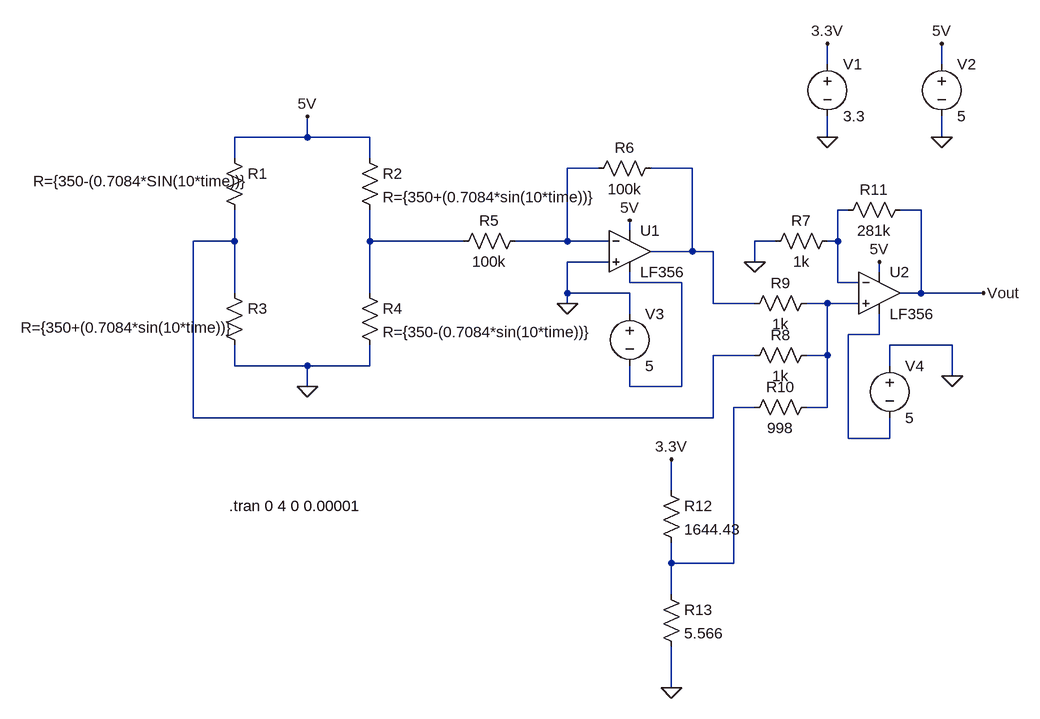
[diagram p0: schematic WheatstoneAndAmplifier.asc]
WheatstoneAndAmplifier.asc, the LTspice schematic file:
Version 4
SHEET 1 880 1060
WIRE 80 80 80 48
WIRE 256 80 256 48
WIRE -720 192 -720 160
WIRE -720 192 -832 192
WIRE -624 192 -720 192
WIRE 80 192 80 160
WIRE 256 192 256 160
WIRE -832 224 -832 192
WIRE -624 224 -624 192
WIRE -272 240 -320 240
WIRE -128 240 -192 240
WIRE 112 304 96 304
WIRE 224 304 192 304
WIRE -224 336 -224 320
WIRE -832 352 -832 304
WIRE -832 352 -896 352
WIRE -624 352 -624 304
WIRE -480 352 -624 352
WIRE -320 352 -320 240
WIRE -320 352 -400 352
WIRE -256 352 -320 352
WIRE 0 352 -32 352
WIRE 96 352 96 304
WIRE 96 352 80 352
WIRE -128 368 -128 240
WIRE -128 368 -192 368
WIRE -96 368 -128 368
WIRE -256 384 -320 384
WIRE -32 384 -32 352
WIRE 160 400 160 384
WIRE -224 416 -224 400
WIRE -144 416 -224 416
WIRE 96 416 96 352
WIRE 128 416 96 416
WIRE -832 432 -832 352
WIRE -624 432 -624 352
WIRE -320 432 -320 384
WIRE -224 432 -320 432
WIRE 224 432 224 304
WIRE 224 432 192 432
WIRE 320 432 224 432
WIRE -320 448 -320 432
WIRE -96 448 -96 368
WIRE -32 448 -96 448
WIRE 80 448 48 448
WIRE 128 448 80 448
WIRE -224 464 -224 432
WIRE 160 496 160 464
WIRE 160 496 112 496
WIRE 272 512 176 512
WIRE -32 528 -96 528
WIRE 80 528 80 448
WIRE 80 528 48 528
WIRE -832 544 -832 512
WIRE -720 544 -832 544
WIRE -624 544 -624 512
WIRE -624 544 -720 544
WIRE 176 544 176 512
WIRE 272 560 272 512
WIRE -720 576 -720 544
WIRE -224 576 -224 544
WIRE -144 576 -144 416
WIRE -144 576 -224 576
WIRE -32 608 -64 608
WIRE 80 608 80 528
WIRE 80 608 48 608
WIRE -896 624 -896 352
WIRE -96 624 -96 528
WIRE -96 624 -896 624
WIRE 112 656 112 496
WIRE 176 656 176 624
WIRE 176 656 112 656
WIRE -160 736 -160 688
WIRE -160 848 -160 816
WIRE -64 848 -64 608
WIRE -64 848 -160 848
WIRE -160 896 -160 848
WIRE -160 1040 -160 976
FLAG 80 192 0
FLAG 256 192 0
FLAG 80 48 3.3V
FLAG 256 48 5V
FLAG -720 576 0
FLAG -720 160 5V
FLAG -320 448 0
FLAG -32 384 0
FLAG 320 432 Vout
FLAG -160 1040 0
FLAG -160 688 3.3V
FLAG -224 320 5V
FLAG 160 384 5V
FLAG 272 560 0
SYMBOL voltage 80 64 R0
WINDOW 123 0 0 Left 0
WINDOW 39 0 0 Left 0
SYMATTR InstName V1
SYMATTR Value 3.3
SYMBOL voltage 256 64 R0
WINDOW 123 0 0 Left 0
WINDOW 39 0 0 Left 0
SYMATTR InstName V2
SYMATTR Value 5
SYMBOL res -848 208 R0
WINDOW 3 -294 52 Left 2
SYMATTR InstName R1
SYMATTR Value R={350-(0.7084*SIN(10*time))}
SYMBOL res -640 208 R0
SYMATTR InstName R2
SYMATTR Value R={350+(0.7084*sin(10*time))}
SYMBOL res -848 416 R0
WINDOW 3 -313 69 Left 2
SYMATTR InstName R3
SYMATTR Value R={350+(0.7084*sin(10*time))}
SYMBOL res -640 416 R0
SYMATTR InstName R4
SYMATTR Value R={350-(0.7084*sin(10*time))}
SYMBOL res -384 336 R90
WINDOW 0 0 56 VBottom 2
WINDOW 3 32 56 VTop 2
SYMATTR InstName R5
SYMATTR Value 100k
SYMATTR SpiceLine tol=5 pwr=.5
SYMBOL res -176 224 R90
WINDOW 0 0 56 VBottom 2
WINDOW 3 32 56 VTop 2
SYMATTR InstName R6
SYMATTR Value 100k
SYMATTR SpiceLine tol=5 pwr=.5
SYMBOL res 96 336 R90
WINDOW 0 0 56 VBottom 2
WINDOW 3 32 56 VTop 2
SYMATTR InstName R7
SYMATTR Value 1k
SYMBOL res 64 512 R90
WINDOW 0 0 56 VBottom 2
WINDOW 3 32 56 VTop 2
SYMATTR InstName R8
SYMATTR Value 1k
SYMATTR SpiceLine tol=5 pwr=.5
SYMBOL res 64 432 R90
WINDOW 0 0 56 VBottom 2
WINDOW 3 32 56 VTop 2
SYMATTR InstName R9
SYMATTR Value 1k
SYMATTR SpiceLine tol=5 pwr=.5
SYMBOL res 64 592 R90
WINDOW 0 0 56 VBottom 2
WINDOW 3 32 56 VTop 2
SYMATTR InstName R10
SYMATTR Value 998
SYMATTR SpiceLine tol=5 pwr=.5
SYMBOL res 208 288 R90
WINDOW 0 0 56 VBottom 2
WINDOW 3 32 56 VTop 2
SYMATTR InstName R11
SYMATTR Value 281k
SYMATTR SpiceLine tol=5 pwr=.5
SYMBOL res -176 720 R0
SYMATTR InstName R12
SYMATTR Value 1644.43
SYMATTR SpiceLine tol=5 pwr=.5
SYMBOL res -176 880 R0
SYMATTR InstName R13
SYMATTR Value 5.566
SYMATTR SpiceLine tol=5 pwr=.5
SYMBOL Opamps\\LF356 -224 304 R0
SYMATTR InstName U1
SYMBOL voltage -224 448 R0
WINDOW 123 0 0 Left 0
WINDOW 39 0 0 Left 0
SYMATTR InstName V3
SYMATTR Value 5
SYMBOL Opamps\\LF356 160 368 R0
SYMATTR InstName U2
SYMBOL voltage 176 528 R0
WINDOW 123 0 0 Left 0
WINDOW 39 0 0 Left 0
SYMATTR InstName V4
SYMATTR Value 5
TEXT -840 760 Left 2 !.tran 0 4 0 0.00001

The netlist it stands for:
* WheatstoneAndAmplifier.asc
V1 3.3V 0 3.3
V2 5V 0 5
R1 5V N004 R={350-(0.7084*SIN(10*time))}
R2 5V N005 R={350+(0.7084*sin(10*time))}
R3 N004 0 R={350+(0.7084*sin(10*time))}
R4 N005 0 R={350-(0.7084*sin(10*time))}
R5 N001 N005 100k tol=5 pwr=.5
R6 N002 N001 100k tol=5 pwr=.5
R7 N003 0 1k
R8 N007 N004 1k tol=5 pwr=.5
R9 N007 N002 1k tol=5 pwr=.5
R10 N007 N009 998 tol=5 pwr=.5
R11 Vout N003 281k tol=5 pwr=.5
R12 3.3V N009 1644.43 tol=5 pwr=.5
R13 N009 0 5.566 tol=5 pwr=.5
XU1 0 N001 5V N006 N002 LF356  ; pins In+ In- V+ V- OUT
V3 0 N006 5
XU2 N007 N003 5V N008 Vout LF356  ; pins In+ In- V+ V- OUT
V4 0 N008 5
.tran 0 4 0 0.00001
.lib LF356.sub
.backanno
.end